# Altium schematic sheet Telephone.SchDoc (part 3 of 3)
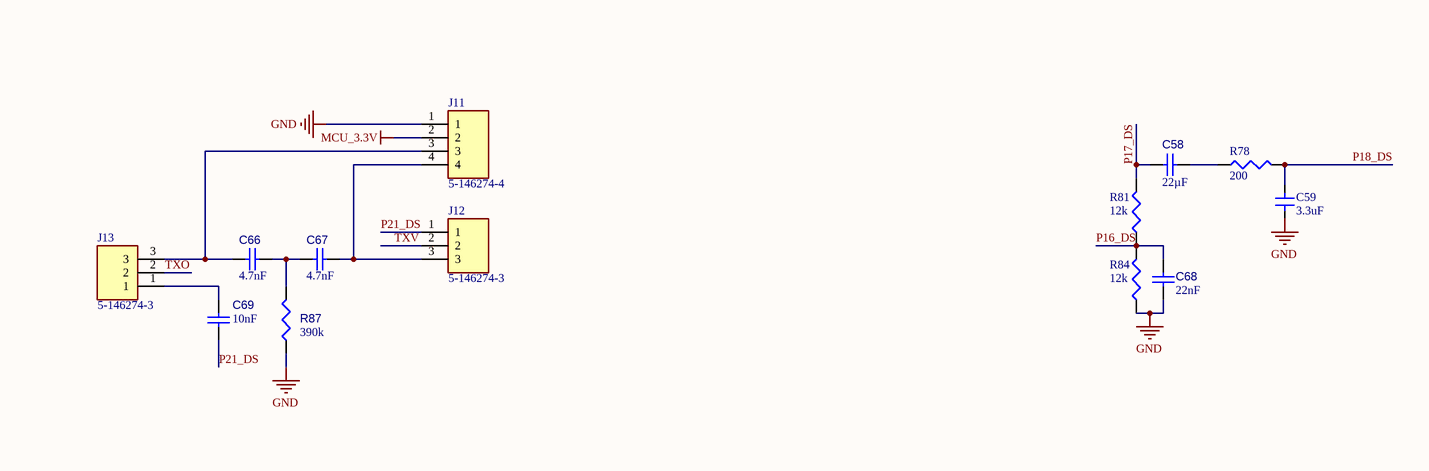
[diagram p5: Telephone.SchDoc, bottom right]

## Library data of the parts (continued)
R29 R30 R35 R39 R76 R79 = CMP-009-00289-1: Res Thick Film 0805 1.2K Ohm 1% 0.125W(1/8W) ±100ppm/C Molded SMD Paper Tape on Plastic Reel; Manufacturer: Bourns; Manufacturer Part Number: CR0805-FX-1201ELF; Power Rating: 125mW; Voltage Rating: 150V; Temperature Coefficient: 100ppm/°C; RoHS: Yes; Category: Chip SMD Resistors; Stock 1: 89998; Pricing 1: 1=0.1, 10=0.029, 50=0.029, 100=0.012, 1000=0.006, 10000=0.003 (USD); Mount: Surface Mount; Case/Package: 0805; Case Code (Metric): 2012; Contact Plating: Tin; Min Operating Temperature: -55°C; Max Operating Temperature: 155°C; Package Quantity: 5000; Packaging: Tape and Reel; Tolerance: 1%; Number of Terminations: 2; Termination: SMD/SMT; Max Power Dissipation: 125mW; Features: Moisture Resistant; Series: CR0805; Length: 0.079inch; Width: 1.25mm; Height: 0.024inch; Thickness: 508um; Radiation Hardening: No; RoHS Compliant: Yes; ComponentLink1URL: https://datasheet.ciiva.com/9123/chpreztr-9123541.pdf?src-supplier=Avnet; ComponentLink1Description: https://datasheet.ciiva.com/9123/chpreztr-9123541.pdf?src-supplier=Avnet; ComponentLink2URL: https://datasheet.ciiva.com/5581/chpreztr-5581383.pdf?src-supplier=Mouser; ComponentLink2Description: https://datasheet.ciiva.com/5581/chpreztr-5581383.pdf?src-supplier=Mouser; Design Item ID: CR0805-FX-1201ELF; Component Type: Standard; Pin Count: 2; Source: V4-TEL.SCHLIB
R31 = CMP-009-00303-1: Res Thick Film 0603 30 Ohm 1% 0.2W(1/5W) ±200ppm/°C Molded SMD Punched Carrier T/R; Manufacturer: Panasonic; Manufacturer Part Number: ERJP03F30R0V; Power Rating: 200mW; Voltage Rating: 150V; RoHS: Yes; Category: Chip SMD Resistors; Stock 1: 2224; Pricing 1: 1=0.36, 10=0.264, 50=0.264, 100=0.126, 1000=0.052, 10000=0.04 (USD); Mount: Surface Mount; Case/Package: 0603; Case Code (Metric): 1608; Min Operating Temperature: -55°C; Max Operating Temperature: 155°C; Tolerance: 1%; Packaging: Tape and Reel; Package Quantity: 5000; Resistor Type: Thick Film; Temperature Coefficient: 200ppm/°C; Voltage Rating (DC): 150V; Termination: Tab; Features: Automotive AEC-Q200; Series: ERJ; Max Power Dissipation: 200mW; Number of Terminations: 2; Resistance Tolerance: 1%; Technology: THICK FILM; Length: 1.6mm; Width: 0.8mm; Height: 0.45mm; Depth: 0.8mm; Ratings: AEC-Q200; Reach SVHC Compliant: No; RoHS Compliant: Yes; ComponentLink1URL: https://datasheet.ciiva.com/11817/0900766b812cb812-11817099.pdf?src-supplier=Rs; ComponentLink1Description: https://datasheet.ciiva.com/11817/0900766b812cb812-11817099.pdf?src-supplier=Rs; ComponentLink2URL: https://datasheet.ciiva.com/48426/erjp-series-eng-tds-48426890.pdf?src-supplier=Distrelec; ComponentLink2Description: https://datasheet.ciiva.com/48426/erjp-series-eng-tds-48426890.pdf?src-supplier=Distrelec; ComponentLink3URL: https://datasheet.ciiva.com/48537/erjp-series-eng-tds-48537514.pdf?src-supplier=Distrelec; ComponentLink3Description: https://datasheet.ciiva.com/48537/erjp-series-eng-tds-48537514.pdf?src-supplier=Distrelec; ComponentLink4URL: https://datasheet.ciiva.com/22739/1790600-22739766.pdf?src-supplier=Element14; ComponentLink4Description: https://datasheet.ciiva.com/22739/1790600-22739766.pdf?src-supplier=Element14; ComponentLink5URL: https://datasheet.ciiva.com/24032/aoa0000ce4-64075-24032235.pdf?src-supplier=Mouser; ComponentLink5Description: https://datasheet.ciiva.com/24032/aoa0000ce4-64075-24032235.pdf?src-supplier=Mouser; Pins: 2; Design Item ID: ERJP03F30R0V; Component Type: Standard; Pin Count: 2; Source: V4-TEL.SCHLIB
R33 = CMP-009-00295-1: Res Thick Film 0805 2K Ohm 5% 1/8W ±200ppm/°C Molded SMD SMD Paper Tape on Plastic Reel; Manufacturer: Bourns; Manufacturer Part Number: CR0805-JW-202ELF; Power Rating: 125mW; Voltage Rating: 150V; RoHS: Yes; Category: Chip SMD Resistors; Stock 1: 147283; Pricing 1: 1=0.1, 10=0.024, 50=0.024, 100=0.01, 1000=0.005, 10000=0.003 (USD); Mount: Surface Mount; Case/Package: 0805; Case Code (Metric): 2012; Contact Plating: Tin; Min Operating Temperature: -55°C; Max Operating Temperature: 155°C; Tolerance: 5%; Packaging: Tape and Reel; Package Quantity: 1; Resistor Type: Thick Film; Termination: SMD/SMT; Number of Terminations: 2; Temperature Coefficient: 200ppm/°C; Max Power Dissipation: 125mW; Voltage Rating (DC): 150V; Features: Moisture Resistant; Series: CR0805; Resistance Tolerance: 5%; Length: 0.079inch; Width: 1.25mm; Height: 0.024inch; Thickness: 508um; Radiation Hardening: No; Reach SVHC Compliant: No; RoHS Compliant: Yes; ComponentLink1URL: https://datasheet.ciiva.com/18594/chpreztr-18594853.pdf?src-supplier=Digi-Key; ComponentLink1Description: https://datasheet.ciiva.com/18594/chpreztr-18594853.pdf?src-supplier=Digi-Key; ComponentLink2URL: https://datasheet.ciiva.com/18594/chpreztr-18594854.pdf?src-supplier=Digi-Key; ComponentLink2Description: https://datasheet.ciiva.com/18594/chpreztr-18594854.pdf?src-supplier=Digi-Key; ComponentLink3URL: https://datasheet.ciiva.com/18594/chpreztr-18594855.pdf?src-supplier=Digi-Key; ComponentLink3Description: https://datasheet.ciiva.com/18594/chpreztr-18594855.pdf?src-supplier=Digi-Key; Design Item ID: CR0805-JW-202ELF; Component Type: Standard; Pin Count: 2; Source: V4-TEL.SCHLIB
R34 = CMP-009-00322-1: Res Thick Film 0805 100K Ohm 1% 1/8W ±100ppm/°C Molded SMD Paper T/R; Manufacturer: Yageo; Power: 125mW; Voltage Rating: 150V; Case/Package: 0805; Pins: 2; RoHS Compliant: True; Mounting Technology: SM; Tolerance: 1%; Max Operating Temperature: 155°C; Min Operating Temperature: -55°C; Contact Plating: Tin,Matte; Height: 500um; Lead Free: Lead Free; Length: 2mm; Packaging: Cut Tape; Radiation Hardening: No; Reach SVHC Compliant: Yes; Resistor Type: Thick Film; Temperature Coefficient: 100ppm/°C; Voltage Rating (DC): 150V; Width: 1.25mm; Manufacturer Part Number: RC0805FR-07100KL
R36 = CMP-009-00293-1: Res Thick Film 0805 300 Ohm 1% 1/8W ±100ppm/°C Molded SMD SMD Paper Tape on Plastic Reel; Manufacturer: Bourns; Manufacturer Part Number: CR0805-FX-3000ELF; Power Rating: 125mW; Voltage Rating: 150V; RoHS: Yes; Category: Chip SMD Resistors; Stock 1: 32741; Pricing 1: 1=0.1, 10=0.034, 50=0.034, 100=0.014, 1000=0.007, 10000=0.003 (USD); Mount: Surface Mount; Case/Package: 0805; Case Code (Metric): 2012; Contact Plating: Tin; Min Operating Temperature: -55°C; Max Operating Temperature: 155°C; Packaging: Tape and Reel; Tolerance: 1%; Package Quantity: 1; Termination: SMD/SMT; Number of Terminations: 2; Temperature Coefficient: 100ppm/°C; Max Power Dissipation: 125mW; Features: Moisture Resistant; Series: CR0805; Length: 0.079inch; Width: 1.25mm; Height: 0.024inch; Thickness: 508um; Radiation Hardening: No; RoHS Compliant: Yes; ComponentLink1URL: https://datasheet.ciiva.com/18608/chpreztr-18608507.pdf?src-supplier=Digi-Key; ComponentLink1Description: https://datasheet.ciiva.com/18608/chpreztr-18608507.pdf?src-supplier=Digi-Key; ComponentLink2URL: https://datasheet.ciiva.com/18608/chpreztr-18608508.pdf?src-supplier=Digi-Key; ComponentLink2Description: https://datasheet.ciiva.com/18608/chpreztr-18608508.pdf?src-supplier=Digi-Key; ComponentLink3URL: https://datasheet.ciiva.com/18608/chpreztr-18608509.pdf?src-supplier=Digi-Key; ComponentLink3Description: https://datasheet.ciiva.com/18608/chpreztr-18608509.pdf?src-supplier=Digi-Key; Design Item ID: CR0805-FX-3000ELF; Component Type: Standard; Pin Count: 2; Source: V4-TEL.SCHLIB
R37 R47 R49 R73 R86 = CMP-009-00213-1: Res Thick Film 0603 10K Ohm 5% 1/10W 200ppm/C Molded SMD SMD Paper T/R; Manufacturer 1: Vishay Dale; Voltage Rating: 75V; Max Power Dissipation: 100mW; Temperature Coefficient: 200ppm/°C; Case/Package: 0603; Pins: 2; RoHS Compliant: Yes; Min Operating Temperature: -55°C; Max Operating Temperature: 155°C; Tolerance: 5%; Design Item ID: CRCW060310K0JNEA; Case Code (Metric): 1608; Category: Chip SMD Resistors; Construction: Rectangular; Contact Plating: Tin; Depth: 0.85mm; Features: Automotive AEC-Q200; Height: 0.02inch; Lead Free: Lead Free; Length: 1.55mm; Manufacturer Part Number 1: CRCW060310K0JNEA; Military Standard: Not; Mount: Surface Mount; Number of Terminations: 2; Package Quantity: 1; Packaging: Tape and Reel; Power Rating: 100mW; Pricing 1: 1=0.10000, 10=0.03300, 100=0.01360, 1000=0.00610, 2500=0.00529 (USD); Radiation Hardening: No; REACH SVHC: Unknown; Resistance Tolerance: 5%; Resistor Type: Thick Film; RoHS: Yes; Series: CRCW; Size Code: 0603; Source: PTZLib.SchLib; Stock 1: 41; Termination: SMD/SMT; Voltage Rating (DC): 75V; Weight: 7.1E-05oz; Width: 0.033inch; ComponentLink1Description: https://datasheet.ciiva.com/3256/dcrcwe3-3256943.pdf?src-supplier=Avnet; ComponentLink1URL: https://datasheet.ciiva.com/3256/dcrcwe3-3256943.pdf?src-supplier=Avnet; ComponentLink2Description: https://datasheet.ciiva.com/2461/dcrcwe3-2461971.pdf?src-supplier=Digi-Key; ComponentLink2URL: https://datasheet.ciiva.com/2461/dcrcwe3-2461971.pdf?src-supplier=Digi-Key; ComponentLink3Description: https://datasheet.ciiva.com/2461/dcrcwe3-2461972.pdf?src-supplier=Digi-Key; ComponentLink3URL: https://datasheet.ciiva.com/2461/dcrcwe3-2461972.pdf?src-supplier=Digi-Key; ComponentLink4Description: https://datasheet.ciiva.com/2461/dcrcwe3-2461973.pdf?src-supplier=Digi-Key; ComponentLink4URL: https://datasheet.ciiva.com/2461/dcrcwe3-2461973.pdf?src-supplier=Digi-Key; ComponentLink5Description: https://datasheet.ciiva.com/3256/dcrcwe3-3256942.pdf?src-supplier=Avnet; ComponentLink5URL: https://datasheet.ciiva.com/3256/dcrcwe3-3256942.pdf?src-supplier=Avnet; ComponentLink6Description: https://datasheet.ciiva.com/16343/dcrcwe3-16343525.pdf?src-supplier=Future+Electronics; ComponentLink6URL: https://datasheet.ciiva.com/16343/dcrcwe3-16343525.pdf?src-supplier=Future+Electronics; ComponentLink7Description: https://datasheet.ciiva.com/16755/70201119-16755717.pdf?src-supplier=Allied+Electronics; ComponentLink7URL: https://datasheet.ciiva.com/16755/70201119-16755717.pdf?src-supplier=Allied+Electronics; ComponentLink8Description: https://datasheet.ciiva.com/16515/dcrcwe3-16515020.pdf?src-supplier=Avnet+Asia; ComponentLink8URL: https://datasheet.ciiva.com/16515/dcrcwe3-16515020.pdf?src-supplier=Avnet+Asia; ComponentLink9Description: https://datasheet.ciiva.com/16771/70201119-16771051.pdf?src-supplier=Allied+Electronics; ComponentLink9URL: https://datasheet.ciiva.com/16771/70201119-16771051.pdf?src-supplier=Allied+Electronics
R38 = CMP-009-00302-1: Res Thick Film 0805 8.2K Ohm 5% 1/8W ±200ppm/°C Molded SMD SMD Paper T/R; Manufacturer: Vishay Dale; Manufacturer Part Number: CRCW08058K20JNEA; Power Rating: 125mW; Voltage Rating: 150V; RoHS: Yes; Category: Chip SMD Resistors; Stock 1: 5125; Pricing 1: 1=0.1, 10=0.05, 50=0.05, 100=0.021, 1000=0.01, 10000=0.006 (USD); Case/Package: 0805; Weight: 0.000194oz; Case Code (Metric): 2012; Contact Plating: Tin; Size Code: 0805; Min Operating Temperature: -55°C; Max Operating Temperature: 155°C; Tolerance: 5%; Packaging: Tape and Reel; Package Quantity: 1; Resistor Type: Thick Film; Number of Terminations: 2; Max Power Dissipation: 125mW; Temperature Coefficient: 200ppm/°C; Voltage Rating (DC): 150V; Features: Automotive AEC-Q200; Series: CRCW; Resistance Tolerance: 5%; Termination: SMD/SMT; Technology: THICK FILM; Length: 2mm; Width: 0.049inch; Height: 0.45mm; Depth: 1.25mm; Radiation Hardening: No; Lead Free: Lead Free; RoHS Compliant: Yes; Reach SVHC Compliant: Unknown; ComponentLink1URL: https://datasheet.ciiva.com/2464/dcrcwe3-2464855.pdf?src-supplier=Digi-Key; ComponentLink1Description: https://datasheet.ciiva.com/2464/dcrcwe3-2464855.pdf?src-supplier=Digi-Key; ComponentLink2URL: https://datasheet.ciiva.com/2464/dcrcwe3-2464856.pdf?src-supplier=Digi-Key; ComponentLink2Description: https://datasheet.ciiva.com/2464/dcrcwe3-2464856.pdf?src-supplier=Digi-Key; ComponentLink3URL: https://datasheet.ciiva.com/2464/dcrcwe3-2464857.pdf?src-supplier=Digi-Key; ComponentLink3Description: https://datasheet.ciiva.com/2464/dcrcwe3-2464857.pdf?src-supplier=Digi-Key; ComponentLink4URL: https://datasheet.ciiva.com/16397/dcrcwe3-16397273.pdf?src-supplier=Future+Electronics; ComponentLink4Description: https://datasheet.ciiva.com/16397/dcrcwe3-16397273.pdf?src-supplier=Future+Electronics; ComponentLink5URL: https://datasheet.ciiva.com/5550/dcrcwe3-109170-5550397.pdf?src-supplier=Mouser; ComponentLink5Description: https://datasheet.ciiva.com/5550/dcrcwe3-109170-5550397.pdf?src-supplier=Mouser; ComponentLink6URL: https://datasheet.ciiva.com/9056/dcrcwe3-9056269.pdf?src-supplier=Avnet; ComponentLink6Description: https://datasheet.ciiva.com/9056/dcrcwe3-9056269.pdf?src-supplier=Avnet; ComponentLink7URL: https://datasheet.ciiva.com/16773/70201119-16773566.pdf?src-supplier=Allied+Electronics; ComponentLink7Description: https://datasheet.ciiva.com/16773/70201119-16773566.pdf?src-supplier=Allied+Electronics; ComponentLink8URL: https://datasheet.ciiva.com/9056/dcrcwe3-9056271.pdf?src-supplier=Avnet; ComponentLink8Description: https://datasheet.ciiva.com/9056/dcrcwe3-9056271.pdf?src-supplier=Avnet; Design Item ID: CRCW08058K20JNEA; Component Type: Standard; Pin Count: 2; Source: V4-TEL.SCHLIB
R40 = CMP-009-00292-1: Res Thick Film 0805 2.7K Ohm 1% 1/8W ±100ppm/°C Molded SMD SMD Paper Tape on Plastic Reel; Manufacturer: Bourns; Manufacturer Part Number: CR0805-FX-2701ELF; Power Rating: 125mW; Voltage Rating: 150V; RoHS: Yes; Category: Chip SMD Resistors; Stock 1: 44241; Pricing 1: 1=0.1, 10=0.029, 50=0.029, 100=0.012, 1000=0.006, 10000=0.003 (USD); Mount: Surface Mount; Case/Package: 0805; Case Code (Metric): 2012; Contact Plating: Tin; Min Operating Temperature: -55°C; Max Operating Temperature: 155°C; Packaging: Tape and Reel; Package Quantity: 5000; Tolerance: 1%; Termination: SMD/SMT; Number of Terminations: 2; Temperature Coefficient: 100ppm/°C; Max Power Dissipation: 125mW; Features: Moisture Resistant; Series: CR0805; Length: 0.079inch; Width: 1.25mm; Height: 0.024inch; Thickness: 508um; Radiation Hardening: No; RoHS Compliant: Yes; ComponentLink1URL: https://datasheet.ciiva.com/9123/chpreztr-9123127.pdf?src-supplier=Avnet; ComponentLink1Description: https://datasheet.ciiva.com/9123/chpreztr-9123127.pdf?src-supplier=Avnet; ComponentLink2URL: https://datasheet.ciiva.com/18608/chpreztr-18608504.pdf?src-supplier=Digi-Key; ComponentLink2Description: https://datasheet.ciiva.com/18608/chpreztr-18608504.pdf?src-supplier=Digi-Key; ComponentLink3URL: https://datasheet.ciiva.com/18608/chpreztr-18608505.pdf?src-supplier=Digi-Key; ComponentLink3Description: https://datasheet.ciiva.com/18608/chpreztr-18608505.pdf?src-supplier=Digi-Key; ComponentLink4URL: https://datasheet.ciiva.com/18608/chpreztr-18608506.pdf?src-supplier=Digi-Key; ComponentLink4Description: https://datasheet.ciiva.com/18608/chpreztr-18608506.pdf?src-supplier=Digi-Key; Design Item ID: CR0805-FX-2701ELF; Component Type: Standard; Pin Count: 2; Source: V4-TEL.SCHLIB
R41 = CMP-009-00316-1: Surface Mount Chip Resistor, Thick Film, Aec-Q200 Wcr Series, 470 Kohm, 125 Mw, 1%, 150 V Rohs Compliant: Yes; Manufacturer: TT Welwyn; Manufacturer Part Number: WCR0805-470KFI; Power Rating: 125mW; Voltage Rating: 150V; Insulation Resistance: 1GR; Temperature Coefficient: 100ppm/°C; RoHS: Yes; Category: Chip SMD Resistors; Stock 1: 11638; Pricing 1: 1=0.1, 10=0.084, 50=0.084, 100=0.033, 1000=0.015, 10000=0.01 (USD); Case/Package: 0805; Case Code (Metric): 2012; Min Operating Temperature: -55°C; Max Operating Temperature: 155°C; Packaging: Cut Tape; Resistor Type: Thick Film; Voltage Rating (DC): 150V; Resistance Tolerance: 1%; Series: WCR; Width: 1.25mm; Reach SVHC Compliant: No; RoHS Compliant: Yes; ComponentLink1URL: https://datasheet.ciiva.com/7867/1851687-7867286.pdf?src-supplier=Element14; ComponentLink1Description: https://datasheet.ciiva.com/7867/1851687-7867286.pdf?src-supplier=Element14; ComponentLink2URL: https://datasheet.ciiva.com/7867/1851687-7867287.pdf?src-supplier=Element14; ComponentLink2Description: https://datasheet.ciiva.com/7867/1851687-7867287.pdf?src-supplier=Element14; Pins: 2; Design Item ID: WCR0805-470KFI; Component Type: Standard; Pin Count: 2; Source: V4-TEL.SCHLIB
R42 R46 = CMP-009-00311-1: Res Thick Film 0805 82K Ohm 1% 1/8W ±100ppm/°C Molded SMD Paper T/R; Manufacturer: Yageo; Manufacturer Part Number: RC0805FR-0782KL; Power Rating: 125mW; Voltage Rating: 150V; RoHS: Yes; Category: Chip SMD Resistors; Stock 1: 15360; Pricing 1: 1=0.1, 10=0.029, 50=0.029, 100=0.012, 1000=0.006, 10000=0.003 (USD); Case/Package: 0805; Case Code (Metric): 2012; Weight: 0.000194oz; Contact Plating: Tin,Matte; Size Code: 0805; Min Operating Temperature: -55°C; Max Operating Temperature: 155°C; Tolerance: 1%; Packaging: Tape and Reel; Package Quantity: 1; Resistor Type: Thick Film; Number of Terminations: 2; Termination: SMD/SMT; Temperature Coefficient: 100ppm/°C; Max Power Dissipation: 125mW; Features: Moisture Resistant; Series: RC; Construction: Rectangular; Resistance Tolerance: 1%; Technology: THICK FILM; Length: 2mm; Width: 0.049inch; Height: 0.5mm; Depth: 1.25mm; Military Standard: Not; Lead Free: Lead Free; RoHS Compliant: Yes; Reach SVHC Compliant: Unknown; ComponentLink1URL: https://datasheet.ciiva.com/2457/pyu-r-int-thick-7-2457144.pdf?src-supplier=Digi-Key; ComponentLink1Description: https://datasheet.ciiva.com/2457/pyu-r-int-thick-7-2457144.pdf?src-supplier=Digi-Key; ComponentLink2URL: https://datasheet.ciiva.com/2457/pyu-r-int-thick-7-2457145.pdf?src-supplier=Digi-Key; ComponentLink2Description: https://datasheet.ciiva.com/2457/pyu-r-int-thick-7-2457145.pdf?src-supplier=Digi-Key; ComponentLink3URL: https://datasheet.ciiva.com/2457/pyu-r-int-thick-7-2457143.pdf?src-supplier=Digi-Key; ComponentLink3Description: https://datasheet.ciiva.com/2457/pyu-r-int-thick-7-2457143.pdf?src-supplier=Digi-Key; ComponentLink4URL: https://datasheet.ciiva.com/12577/rc0805-12577609.pdf?src-supplier=Mouser; ComponentLink4Description: https://datasheet.ciiva.com/12577/rc0805-12577609.pdf?src-supplier=Mouser; ComponentLink5URL: https://datasheet.ciiva.com/16747/rc0805-16747260.pdf?src-supplier=Future+Electronics; ComponentLink5Description: https://datasheet.ciiva.com/16747/rc0805-16747260.pdf?src-supplier=Future+Electronics; Design Item ID: RC0805FR-0782KL; Component Type: Standard; Pin Count: 2; Source: V4-TEL.SCHLIB
R45 R66 R67 R72 = CMP-009-00308-1: Res Thick Film 0805 330K Ohm 1% 1/8W ±100ppm/°C Molded SMD Paper T/R; Manufacturer: Yageo; Manufacturer Part Number: RC0805FR-07330KL; Power Rating: 125mW; Voltage Rating: 150V; RoHS: Yes; Category: Chip SMD Resistors; Stock 1: 220926; Pricing 1: 1=0.1, 10=0.033, 50=0.033, 100=0.014, 1000=0.007, 10000=0.003 (USD); Case/Package: 0805; Case Code (Metric): 2012; Contact Plating: Tin,Matte; Size Code: 0805; Min Operating Temperature: -55°C; Max Operating Temperature: 155°C; Tolerance: 1%; Package Quantity: 1; Packaging: Tape and Reel; Resistor Type: Thick Film; Number of Terminations: 2; Termination: SMD/SMT; Temperature Coefficient: 100ppm/°C; Max Power Dissipation: 125mW; Features: Moisture Resistant; Series: RC; Resistance Tolerance: 1%; Construction: Rectangular; Technology: THICK FILM; Length: 0.079inch; Width: 0.049inch; Height: 0.024inch; Depth: 1.25mm; Military Standard: Not; Lead Free: Lead Free; RoHS Compliant: Yes; Reach SVHC Compliant: Unknown; ComponentLink1URL: https://datasheet.ciiva.com/2457/pyu-r-int-thick-7-2457090.pdf?src-supplier=Digi-Key; ComponentLink1Description: https://datasheet.ciiva.com/2457/pyu-r-int-thick-7-2457090.pdf?src-supplier=Digi-Key; ComponentLink2URL: https://datasheet.ciiva.com/2457/pyu-r-int-thick-7-2457091.pdf?src-supplier=Digi-Key; ComponentLink2Description: https://datasheet.ciiva.com/2457/pyu-r-int-thick-7-2457091.pdf?src-supplier=Digi-Key; ComponentLink3URL: https://datasheet.ciiva.com/2457/pyu-r-int-thick-7-2457089.pdf?src-supplier=Digi-Key; ComponentLink3Description: https://datasheet.ciiva.com/2457/pyu-r-int-thick-7-2457089.pdf?src-supplier=Digi-Key; ComponentLink4URL: https://datasheet.ciiva.com/12667/rc0805-12667006.pdf?src-supplier=Mouser; ComponentLink4Description: https://datasheet.ciiva.com/12667/rc0805-12667006.pdf?src-supplier=Mouser; ComponentLink5URL: https://datasheet.ciiva.com/7941/444164-7941766.pdf?src-supplier=Element14; ComponentLink5Description: https://datasheet.ciiva.com/7941/444164-7941766.pdf?src-supplier=Element14; ComponentLink6URL: https://datasheet.ciiva.com/7941/444164-7941767.pdf?src-supplier=Element14; ComponentLink6Description: https://datasheet.ciiva.com/7941/444164-7941767.pdf?src-supplier=Element14; ComponentLink7URL: https://datasheet.ciiva.com/17197/rc0805-17197631.pdf?src-supplier=Future+Electronics; ComponentLink7Description: https://datasheet.ciiva.com/17197/rc0805-17197631.pdf?src-supplier=Future+Electronics; Design Item ID: RC0805FR-07330KL; Component Type: Standard; Pin Count: 2; Source: V4-TEL.SCHLIB
R48 R81 R84 = CMP-009-00306-1: Res Thick Film 0805 12K Ohm 1% 0.125W(1/8W) ±100ppm/C Pad SMD T/R; Manufacturer: Yageo; Manufacturer Part Number: RC0805FR-0712KL; Temperature Coefficient: 100ppm/°C; Power Rating: 125mW; Voltage Rating: 150V; RoHS: Yes; Category: Chip SMD Resistors; Stock 1: 240573; Pricing 1: 1=0.1, 10=0.024, 50=0.024, 100=0.012, 1000=0.007, 10000=0.004 (USD); Case/Package: 0805; Case Code (Metric): 2012; Weight: 0.000194oz; Size Code: 0805; Min Operating Temperature: -55°C; Max Operating Temperature: 155°C; Tolerance: 1%; Packaging: Cut Tape; Resistor Type: Thick Film; Package Quantity: 1; Termination: SMD/SMT; Number of Terminations: 2; Max Power Dissipation: 125mW; Features: Moisture Resistant; Series: RC; Resistance Tolerance: 1%; Length: 0.079inch; Width: 0.049inch; Height: 0.024inch; Lead Free: Lead Free; Reach SVHC Compliant: Unknown; RoHS Compliant: Yes; ComponentLink1URL: https://datasheet.ciiva.com/2519/pyu-r-int-thick-7-2519832.pdf?src-supplier=Digi-Key; ComponentLink1Description: https://datasheet.ciiva.com/2519/pyu-r-int-thick-7-2519832.pdf?src-supplier=Digi-Key; ComponentLink2URL: https://datasheet.ciiva.com/2519/pyu-r-int-thick-7-2519833.pdf?src-supplier=Digi-Key; ComponentLink2Description: https://datasheet.ciiva.com/2519/pyu-r-int-thick-7-2519833.pdf?src-supplier=Digi-Key; ComponentLink3URL: https://datasheet.ciiva.com/2519/pyu-r-int-thick-7-2519831.pdf?src-supplier=Digi-Key; ComponentLink3Description: https://datasheet.ciiva.com/2519/pyu-r-int-thick-7-2519831.pdf?src-supplier=Digi-Key; ComponentLink4URL: https://datasheet.ciiva.com/12577/rc0805-12577253.pdf?src-supplier=Mouser; ComponentLink4Description: https://datasheet.ciiva.com/12577/rc0805-12577253.pdf?src-supplier=Mouser; ComponentLink5URL: https://datasheet.ciiva.com/7941/444164-7941693.pdf?src-supplier=Element14; ComponentLink5Description: https://datasheet.ciiva.com/7941/444164-7941693.pdf?src-supplier=Element14; ComponentLink6URL: https://datasheet.ciiva.com/7941/444164-7941694.pdf?src-supplier=Element14; ComponentLink6Description: https://datasheet.ciiva.com/7941/444164-7941694.pdf?src-supplier=Element14; ComponentLink7URL: https://datasheet.ciiva.com/17018/rc0805-17018634.pdf?src-supplier=Future+Electronics; ComponentLink7Description: https://datasheet.ciiva.com/17018/rc0805-17018634.pdf?src-supplier=Future+Electronics; Design Item ID: RC0805FR-0712KL; Component Type: Standard; Pin Count: 2; Source: V4-TEL.SCHLIB
R50 R51 R63 = CMP-009-00321-1: Res Thick Film 0805 18K Ohm 1% 1/8W ±100ppm/°C Molded SMD SMD Paper T/R; Manufacturer: Yageo; Manufacturer Part Number: RC0805FR-1018KL; Power: 125mW; Case/Package: 0805; Contact Plating: Tin,Matte; Min Operating Temperature: -55°C; Max Operating Temperature: 155°C; Tolerance: 1%; RoHS Compliant: Yes; Mounting Technology: SMT; Pins: 2
R53 R54 = CMP-009-00300-1: Res Thick Film 0805 1M Ohm 5% 0.125W(1/8W) ±200ppm/°C Pad SMD T/R; Manufacturer: Vishay; Manufacturer Part Number: CRCW08051M00JNEAC; RoHS: No; Category: Chip SMD Resistors; Stock 1: 24891; Pricing 1: 1=0.1, 10=0.042, 50=0.042, 100=0.017, 1000=0.008, 10000=0.005 (USD); Design Item ID: CRCW08051M00JNEAC; Component Type: Standard; Pin Count: 2; Source: V4-TEL.SCHLIB
R55 = CMP-009-00301-2: CRCW Thick Film Commodity Chip Resistor 0805 Size 680 Ohm 5% 0.125 W 200 ppm/K 2-Pin SMD Paper T/R; Manufacturer: Vishay; Power: 125mW; Manufacturer Part Number: CRCW0805680RJNEBC; Category: Chip SMD Resistors; Mounting Technology: SMT; Pins: 2; RoHS Compliant: No; Tolerance: 5%
R57 = CMP-009-00305-1: RC Series 0805 0.125 W 0 Ohm Jumper SMT Thick Film Chip Resistor; Manufacturer: Yageo; Manufacturer Part Number: RC0805FR-070RL; Tolerance: 1%; Power Rating: 125mW; RoHS: Yes; Category: Chip SMD Resistors; Stock 1: 550673; Pricing 1: 1=0.1, 10=0.039, 50=0.039, 100=0.016, 1000=0.008, 10000=0.004 (USD); Case/Package: 0805; Contact Plating: Tin,Matte; Case Code (Metric): 2012; Size Code: 0805; Min Operating Temperature: -55°C; Max Operating Temperature: 155°C; Packaging: Tape and Reel; Features: Moisture Resistant; Series: RC; Max Power Dissipation: 125mW; Number of Terminations: 2; Construction: Rectangular; Length: 2mm; Depth: 1.25mm; Military Standard: Not; Lead Free: Lead Free; RoHS Compliant: Yes; ComponentLink1URL: https://datasheet.ciiva.com/15189/getdatasheetpartid-348154-15189885.pdf?src-supplier=Verical; ComponentLink1Description: https://datasheet.ciiva.com/15189/getdatasheetpartid-348154-15189885.pdf?src-supplier=Verical; ComponentLink2URL: https://datasheet.ciiva.com/17042/rc0805-17042698.pdf?src-supplier=Future+Electronics; ComponentLink2Description: https://datasheet.ciiva.com/17042/rc0805-17042698.pdf?src-supplier=Future+Electronics; Design Item ID: RC0805FR-070RL; Component Type: Standard; Pin Count: 2; Source: V4-TEL.SCHLIB
R59-R61 = CMP-009-00237-1: Res Thick Film 0603 10K Ohm 5% 1/10W 200ppm/C Molded SMD SMD Paper T/R; Manufacturer: Vishay Dale; Manufacturer Part Number: CRCW060310K0JNEA; Tolerance: 1%; Voltage Rating: 75V; Max Power Dissipation: 333mW; Power Rating: 250mW; Temperature Coefficient: 200ppm/°C; Case/Package: 0603; Pins: 2; RoHS Compliant: Yes; Min Operating Temperature: -55°C; Max Operating Temperature: 155°C; Design Item ID: CRCW060310K0JNEA; Category: Chip SMD Resistors; Construction: Rectangular; Contact Plating: Tin; Depth: 0.85mm; Features: Automotive AEC-Q200; Height: 0.02inch; Lead Free: Lead Free; Length: 1.55mm; Military Standard: Not; Mount: Surface Mount; Number of Terminations: 2; Package Quantity: 1; Packaging: Tape and Reel; Radiation Hardening: No; Resistance Tolerance: 5%; Resistor Type: Thick Film; RoHS: Yes; Series: CRCW; Size Code: 0603; Stock 1: 41; Termination: SMD/SMT; Voltage Rating (DC): 75V; Weight: 7.1E-05oz; Width: 0.033inch; ComponentLink1Description: https://datasheet.ciiva.com/3256/dcrcwe3-3256943.pdf?src-supplier=Avnet; ComponentLink1URL: https://datasheet.ciiva.com/3256/dcrcwe3-3256943.pdf?src-supplier=Avnet; ComponentLink2Description: https://datasheet.ciiva.com/2461/dcrcwe3-2461971.pdf?src-supplier=Digi-Key; ComponentLink2URL: https://datasheet.ciiva.com/2461/dcrcwe3-2461971.pdf?src-supplier=Digi-Key; ComponentLink3Description: https://datasheet.ciiva.com/2461/dcrcwe3-2461972.pdf?src-supplier=Digi-Key; ComponentLink3URL: https://datasheet.ciiva.com/2461/dcrcwe3-2461972.pdf?src-supplier=Digi-Key; ComponentLink4Description: https://datasheet.ciiva.com/2461/dcrcwe3-2461973.pdf?src-supplier=Digi-Key; ComponentLink4URL: https://datasheet.ciiva.com/2461/dcrcwe3-2461973.pdf?src-supplier=Digi-Key; ComponentLink5Description: https://datasheet.ciiva.com/3256/dcrcwe3-3256942.pdf?src-supplier=Avnet; ComponentLink5URL: https://datasheet.ciiva.com/3256/dcrcwe3-3256942.pdf?src-supplier=Avnet; ComponentLink6Description: https://datasheet.ciiva.com/16343/dcrcwe3-16343525.pdf?src-supplier=Future+Electronics; ComponentLink6URL: https://datasheet.ciiva.com/16343/dcrcwe3-16343525.pdf?src-supplier=Future+Electronics; ComponentLink7Description: https://datasheet.ciiva.com/16755/70201119-16755717.pdf?src-supplier=Allied+Electronics; ComponentLink7URL: https://datasheet.ciiva.com/16755/70201119-16755717.pdf?src-supplier=Allied+Electronics; ComponentLink8Description: https://datasheet.ciiva.com/16515/dcrcwe3-16515020.pdf?src-supplier=Avnet+Asia; ComponentLink8URL: https://datasheet.ciiva.com/16515/dcrcwe3-16515020.pdf?src-supplier=Avnet+Asia; ComponentLink9Description: https://datasheet.ciiva.com/16771/70201119-16771051.pdf?src-supplier=Allied+Electronics; ComponentLink9URL: https://datasheet.ciiva.com/16771/70201119-16771051.pdf?src-supplier=Allied+Electronics
R62 = CMP-009-00294-1: Thick Film Resistors 1.5M 5%; Manufacturer: Bourns; Manufacturer Part Number: CR0805-JW-155ELF; Power Rating: 125mW; Voltage Rating: 150V; Temperature Coefficient: 200ppm/°C; RoHS: Yes; Category: Chip SMD Resistors; Stock 1: 77505; Pricing 1: 1=0.1, 10=0.024, 50=0.024, 100=0.01, 1000=0.005, 10000=0.004 (USD); Mount: Surface Mount; Case/Package: 0805; Case Code (Metric): 2012; Contact Plating: Tin; Min Operating Temperature: -55°C; Max Operating Temperature: 155°C; Packaging: Tape and Reel; Package Quantity: 5000; Tolerance: 5%; Termination: SMD/SMT; Number of Terminations: 2; Max Power Dissipation: 125mW; Features: Moisture Resistant; Series: CR0805; Length: 0.079inch; Width: 1.25mm; Height: 0.024inch; Thickness: 508um; Radiation Hardening: No; RoHS Compliant: Yes; ComponentLink1URL: https://datasheet.ciiva.com/5545/chpreztr-5545126.pdf?src-supplier=Mouser; ComponentLink1Description: https://datasheet.ciiva.com/5545/chpreztr-5545126.pdf?src-supplier=Mouser; ComponentLink2URL: https://datasheet.ciiva.com/18608/chpreztr-18608456.pdf?src-supplier=Digi-Key; ComponentLink2Description: https://datasheet.ciiva.com/18608/chpreztr-18608456.pdf?src-supplier=Digi-Key; ComponentLink3URL: https://datasheet.ciiva.com/18608/chpreztr-18608457.pdf?src-supplier=Digi-Key; ComponentLink3Description: https://datasheet.ciiva.com/18608/chpreztr-18608457.pdf?src-supplier=Digi-Key; ComponentLink4URL: https://datasheet.ciiva.com/18608/chpreztr-18608458.pdf?src-supplier=Digi-Key; ComponentLink4Description: https://datasheet.ciiva.com/18608/chpreztr-18608458.pdf?src-supplier=Digi-Key; ComponentLink5URL: https://datasheet.ciiva.com/9123/chpreztr-9123419.pdf?src-supplier=Avnet; ComponentLink5Description: https://datasheet.ciiva.com/9123/chpreztr-9123419.pdf?src-supplier=Avnet; Design Item ID: CR0805-JW-155ELF; Component Type: Standard; Pin Count: 2; Source: V4-TEL.SCHLIB
R64 = CMP-009-00314-1: High Precision-High Stability Chip Resistor Thin Film 0805 47kOhm 1% Paper T/R; Manufacturer: Yageo; Manufacturer Part Number: RT0805FRE0747KL; Power Rating: 125mW; Voltage Rating: 150V; Temperature Coefficient: 50ppm/°C; RoHS: Yes; Category: Chip SMD Resistors; Stock 1: 83330; Pricing 1: 1=0.1, 10=0.081, 50=0.081, 100=0.031, 1000=0.014, 10000=0.009 (USD); Case/Package: 0805; Case Code (Metric): 2012; Min Operating Temperature: -55°C; Max Operating Temperature: 125°C; Tolerance: 1%; Packaging: Tape and Reel; Resistor Type: Thin Film; Termination: SMD/SMT; Number of Terminations: 2; Max Power Dissipation: 125mW; Voltage Rating (DC): 150V; Features: Moisture Resistant; Series: RT; Resistance Tolerance: 1%; Length: 0.079inch; Width: 0.049inch; Height: 0.024inch; Reach SVHC Compliant: No; Lead Free: Lead Free; RoHS Compliant: Yes; ComponentLink1URL: https://datasheet.ciiva.com/7942/1392914-7942152.pdf?src-supplier=Element14; ComponentLink1Description: https://datasheet.ciiva.com/7942/1392914-7942152.pdf?src-supplier=Element14; ComponentLink2URL: https://datasheet.ciiva.com/7942/1392914-7942153.pdf?src-supplier=Element14; ComponentLink2Description: https://datasheet.ciiva.com/7942/1392914-7942153.pdf?src-supplier=Element14; ComponentLink3URL: https://datasheet.ciiva.com/5990/1392914-5990606.pdf?src-supplier=Farnell; ComponentLink3Description: https://datasheet.ciiva.com/5990/1392914-5990606.pdf?src-supplier=Farnell; Pins: 2; Design Item ID: RT0805FRE0747KL; Component Type: Standard; Pin Count: 2; Source: V4-TEL.SCHLIB
R69 = CMP-009-00315-1: anti-surge endured pulse power thick film chip resistor, 0805, RoHS; Manufacturer: KOA Speer; Manufacturer Part Number: SG73P2ATTD222J; Voltage Rating: 150V; Power Rating: 250mW; Tolerance: 5%; Temperature Coefficient: 100ppm/°C; RoHS: Yes; Category: Chip SMD Resistors; Stock 1: 15000; Pricing 1: 1=0.13, 10=0.113, 50=0.113, 100=0.043, 1000=0.018, 10000=0.013 (USD); Case/Package: 0805; Case Code (Metric): 2012; Weight: 0.000194oz; Min Operating Temperature: -55°C; Max Operating Temperature: 155°C; Packaging: Tape and Reel; Termination: SMD/SMT; Voltage Rating (DC): 150V; Series: SG73P; Features: Moisture Resistant,Automotive AEC-Q200; Max Power Dissipation: 250mW; Number of Terminations: 2; Length: 2mm; Width: 1.25mm; Height: 0.5mm; Ratings: AEC-Q200; RoHS Compliant: Yes; ComponentLink1URL: https://datasheet.ciiva.com/5568/sg73-5568998.pdf?src-supplier=Mouser; ComponentLink1Description: https://datasheet.ciiva.com/5568/sg73-5568998.pdf?src-supplier=Mouser; Design Item ID: SG73P2ATTD222J; Component Type: Standard; Pin Count: 2; Source: V4-TEL.SCHLIB
R71 R82 R83 R85 R87 = CMP-009-00320-1: Chip Resistor Precision Grade Thick Film 0805 390kOhm 1% Paper T/R; Max Power Dissipation: 125mW; Temperature Coefficient: 50ppm/°C; Case/Package: 0805; Min Operating Temperature: -55°C; Max Operating Temperature: 155°C; Packaging: Tape and Reel; Number of Terminations: 2; Tolerance: 1%; Features: Moisture Resistant; Series: RE; Length: 0.079inch; Width: 0.049inch; Height: 0.024inch; Lead Free: Lead Free; RoHS Compliant: Yes
R74 = CMP-009-00309-1: Res Thick Film 0805 510K Ohm 1% 1/8W +/-100ppm/ßC Molded SMD Paper T/R; Manufacturer: Yageo; Manufacturer Part Number: RC0805FR-07510KL; Power Rating: 125mW; Voltage Rating: 150V; Temperature Coefficient: 100ppm/°C; RoHS: Yes; Category: Chip SMD Resistors; Stock 1: 104255; Pricing 1: 1=0.1, 10=0.042, 50=0.042, 100=0.017, 1000=0.007, 10000=0.005 (USD); Mount: Surface Mount; Case/Package: 0805; Case Code (Metric): 2012; Size Code: 0805; Min Operating Temperature: -55°C; Max Operating Temperature: 155°C; Packaging: Tape and Reel; Tolerance: 1%; Termination: SMD/SMT; Voltage Rating (DC): 150V; Features: Moisture Resistant; Series: RC; Max Power Dissipation: 125mW; Number of Terminations: 2; Construction: Rectangular; Technology: THICK FILM; Length: 2mm; Height: 0.5mm; Depth: 1.25mm; Military Standard: Not; Lead Free: Lead Free; RoHS Compliant: Yes; ComponentLink1URL: https://datasheet.ciiva.com/11808/0900766b8106beab-11808278.pdf?src-supplier=Rs; ComponentLink1Description: https://datasheet.ciiva.com/11808/0900766b8106beab-11808278.pdf?src-supplier=Rs; ComponentLink2URL: https://datasheet.ciiva.com/12667/rc0805-12667085.pdf?src-supplier=Mouser; ComponentLink2Description: https://datasheet.ciiva.com/12667/rc0805-12667085.pdf?src-supplier=Mouser; Design Item ID: RC0805FR-07510KL; Component Type: Standard; Pin Count: 2; Source: V4-TEL.SCHLIB
R78 = CMP-009-00291-1: Res Thick Film 0805 200 Ohm 1% 1/8W ±100ppm/°C Molded SMD SMD Paper Tape on Plastic Reel; Manufacturer: Bourns; Manufacturer Part Number: CR0805-FX-2000ELF; Power Rating: 125mW; Voltage Rating: 150V; RoHS: Yes; Category: Chip SMD Resistors; Stock 1: 115698; Pricing 1: 1=0.1, 10=0.029, 50=0.029, 100=0.012, 1000=0.006, 10000=0.003 (USD); Mount: Surface Mount; Case/Package: 0805; Case Code (Metric): 2012; Contact Plating: Tin; Min Operating Temperature: -55°C; Max Operating Temperature: 155°C; Packaging: Tape and Reel; Tolerance: 1%; Package Quantity: 5000; Termination: SMD/SMT; Temperature Coefficient: 100ppm/°C; Features: Moisture Resistant; Series: CR0805; Max Power Dissipation: 125mW; Number of Terminations: 2; Length: 2mm; Width: 1.25mm; Height: 0.5mm; Thickness: 508um; Radiation Hardening: No; RoHS Compliant: Yes; ComponentLink1URL: http://components.arrow.com/part/dataview/40998293S2126022N1506?src-supplier=Arrow+Electronics; ComponentLink1Description: http://components.arrow.com/part/dataview/40998293S2126022N1506?src-supplier=Arrow+Electronics; ComponentLink2URL: http://www.farnell.com/datasheets/2178762.pdf?src-supplier=Farnell; ComponentLink2Description: http://www.farnell.com/datasheets/2178762.pdf?src-supplier=Farnell; ComponentLink3URL: http://www.mouser.com/ds/2/54/chpreztr-977002.pdf?src-supplier=Mouser; ComponentLink3Description: http://www.mouser.com/ds/2/54/chpreztr-977002.pdf?src-supplier=Mouser; ComponentLink4URL: http://www.farnell.com/datasheets/2178762.pdf?src-supplier=Newark; ComponentLink4Description: http://www.farnell.com/datasheets/2178762.pdf?src-supplier=Newark; ComponentLink5URL: http://www.bourns.com/pdfs/chpreztr.pdf?src-supplier=Avnet; ComponentLink5Description: http://www.bourns.com/pdfs/chpreztr.pdf?src-supplier=Avnet; ComponentLink6URL: https://www.bourns.com/docs/Product-Datasheets/CHPREZTR.pdf?src-supplier=Digi-Key; ComponentLink6Description: https://www.bourns.com/docs/Product-Datasheets/CHPREZTR.pdf?src-supplier=Digi-Key; ComponentLink7URL: http://www.onlinecomponents.com/datasheet/cr0805-fx-2000elf.aspx?p=10745564&src-supplier=Onlinecomponents.com; ComponentLink7Description: http://www.onlinecomponents.com/datasheet/cr0805-fx-2000elf.aspx?p=10745564&src-supplier=Onlinecomponents.com; Design Item ID: CR0805-FX-2000ELF; Component Type: Standard; Pin Count: 2; Source: V4-TEL.SCHLIB
R80 = CMP-009-00290-1: Res Thick Film 0805 13 Ohm 1% 1/8W ±100ppm/°C Molded SMD SMD Paper Tape on Plastic Reel; Manufacturer: Bourns; Power Rating: 125mW; Voltage Rating: 150V; Manufacturer Part Number: CR0805-FX-13R0ELF; RoHS: Yes; Category: Chip SMD Resistors; Stock 1: 53715; Pricing 1: 1=0.1, 10=0.029, 50=0.029, 100=0.012, 1000=0.006, 10000=0.003 (USD); Mount: Surface Mount; Case/Package: 0805; Case Code (Metric): 2012; Contact Plating: Tin; Min Operating Temperature: -55°C; Max Operating Temperature: 155°C; Packaging: Tape and Reel; Tolerance: 1%; Package Quantity: 5000; Number of Terminations: 2; Termination: SMD/SMT; Temperature Coefficient: 100ppm/°C; Max Power Dissipation: 125mW; Features: Moisture Resistant; Series: CR0805; Length: 0.079inch; Width: 1.25mm; Height: 0.024inch; Thickness: 508um; Radiation Hardening: No; RoHS Compliant: Yes; ComponentLink1URL: https://datasheet.ciiva.com/5577/chpreztr-5577813.pdf?src-supplier=Mouser; ComponentLink1Description: https://datasheet.ciiva.com/5577/chpreztr-5577813.pdf?src-supplier=Mouser; ComponentLink2URL: https://datasheet.ciiva.com/9122/chpreztr-9122173.pdf?src-supplier=Avnet; ComponentLink2Description: https://datasheet.ciiva.com/9122/chpreztr-9122173.pdf?src-supplier=Avnet; Design Item ID: CR0805-FX-13R0ELF; Component Type: Standard; Pin Count: 2; Source: V4-TEL.SCHLIB
TP6-TP20 = CMP-002-00037-1: Test Point, Orange, Height 4.6 mm, Tail Length 3 mm, 1-Pin THD, RoHS; Manufacturer: Keystone; Case/Package: 5003; RoHS Compliant: True; Datasheet URL: http://keyelco.com/userAssets/file/M65p56.pdf; Mounting Technology: TH; Packaging: Bulk; Package Description: 1-Pin Through Hole Device, Dia 2.54 mm; Pins: 1; Diameter: 2.54mm; Package Reference: 5003; Connector Type: TestPoint; Manufacturer URL: http://www.keyelco.com/; Contact Material: Bronze; Datasheet Version: Jun-15; Contact Plating: Tin; Package Quantity: 10; Colour: Orange
U6 = CMP-076-000002-2: AS Series 3 to 5 V Telephone Line Interface and Speakerphone Circuit - SOIC-28; Interface: Serial; Max Supply Voltage: 5V; Min Supply Voltage: 3V; Number of Circuits: 1; Operating Supply Current: 3mA; Design Item ID: AS2523T; Pin Count: 28; RoHS Compliant: Yes; Case/Package: SOIC; Lead Free: Lead Free; Max Operating Temperature: 70°C; Min Operating Temperature: -25°C; Mounting Technology: Surface Mount; Pins: 28; Package Quantity: 1500; Packaging: Tape and Reel; Weight: 0.078125oz
U7 = CMP-084-000000-2: OPTOISOLATOR 5KV TRANS 4SMD; MF: Sharp Microelectronics; Collector-emitter Voltage-Max: 200mV; Forward Voltage: 1.2V; Input Type: DC; Max Output Voltage: 80V; Number of Channels: 1; Output Current per Channel: 50mA; Component Type: Standard; MP: PC817XI; Package: SMD-4 Sharp Microelectronics; Case/Package: SMD/SMT; Max Operating Temperature: 100°C; Min Operating Temperature: -30°C; Mounting Technology: Surface Mount; Pins: 4; RoHS Compliant: No; Lead Free: Contains Lead; Number of Circuits: 1
U8 = CMP-031-00017-1: BA8206 Series 14 to 18 V 450 mW Tone Ringer IC for Telephone Set - SOIC-8; Manufacturer: Rohm; Number of Circuits: 1; Max Power Dissipation: 450mW; Manufacturer Part Number: BA8206F-E2; RoHS: Yes; Category: Integrated Circuits (ICs); Stock 1: 6538; Pricing 1: 1=2.37, 10=2.14, 50=2.02, 100=1.72, 1000=1.3, 10000=1.06 (USD); Mount: Surface Mount; Case/Package: SOP; Min Operating Temperature: -25°C; Max Operating Temperature: 75°C; Packaging: Tape and Reel; Package Quantity: 2500; Series: -; Lead Free: Lead Free; RoHS Compliant: Yes; ComponentLink1URL: https://datasheet.ciiva.com/6631/ba8206f-6631483.pdf?src-supplier=Digi-Key; ComponentLink1Description: https://datasheet.ciiva.com/6631/ba8206f-6631483.pdf?src-supplier=Digi-Key; ComponentLink2URL: https://datasheet.ciiva.com/6631/ba8206f-6631484.pdf?src-supplier=Digi-Key; ComponentLink2Description: https://datasheet.ciiva.com/6631/ba8206f-6631484.pdf?src-supplier=Digi-Key; ComponentLink3URL: https://datasheet.ciiva.com/16421/rohmba8206f-e2-16421738.pdf?src-supplier=Future+Electronics; ComponentLink3Description: https://datasheet.ciiva.com/16421/rohmba8206f-e2-16421738.pdf?src-supplier=Future+Electronics; ComponentLink4URL: https://datasheet.ciiva.com/6631/ba8206f-6631485.pdf?src-supplier=Digi-Key; ComponentLink4Description: https://datasheet.ciiva.com/6631/ba8206f-6631485.pdf?src-supplier=Digi-Key; Pins: 8; Design Item ID: BA8206F-E2; Component Type: Standard; Pin Count: 8; Source: V4-TEL.SCHLIB